# EAGLE design pc_kalam32_dev (EAGLE 6.4)
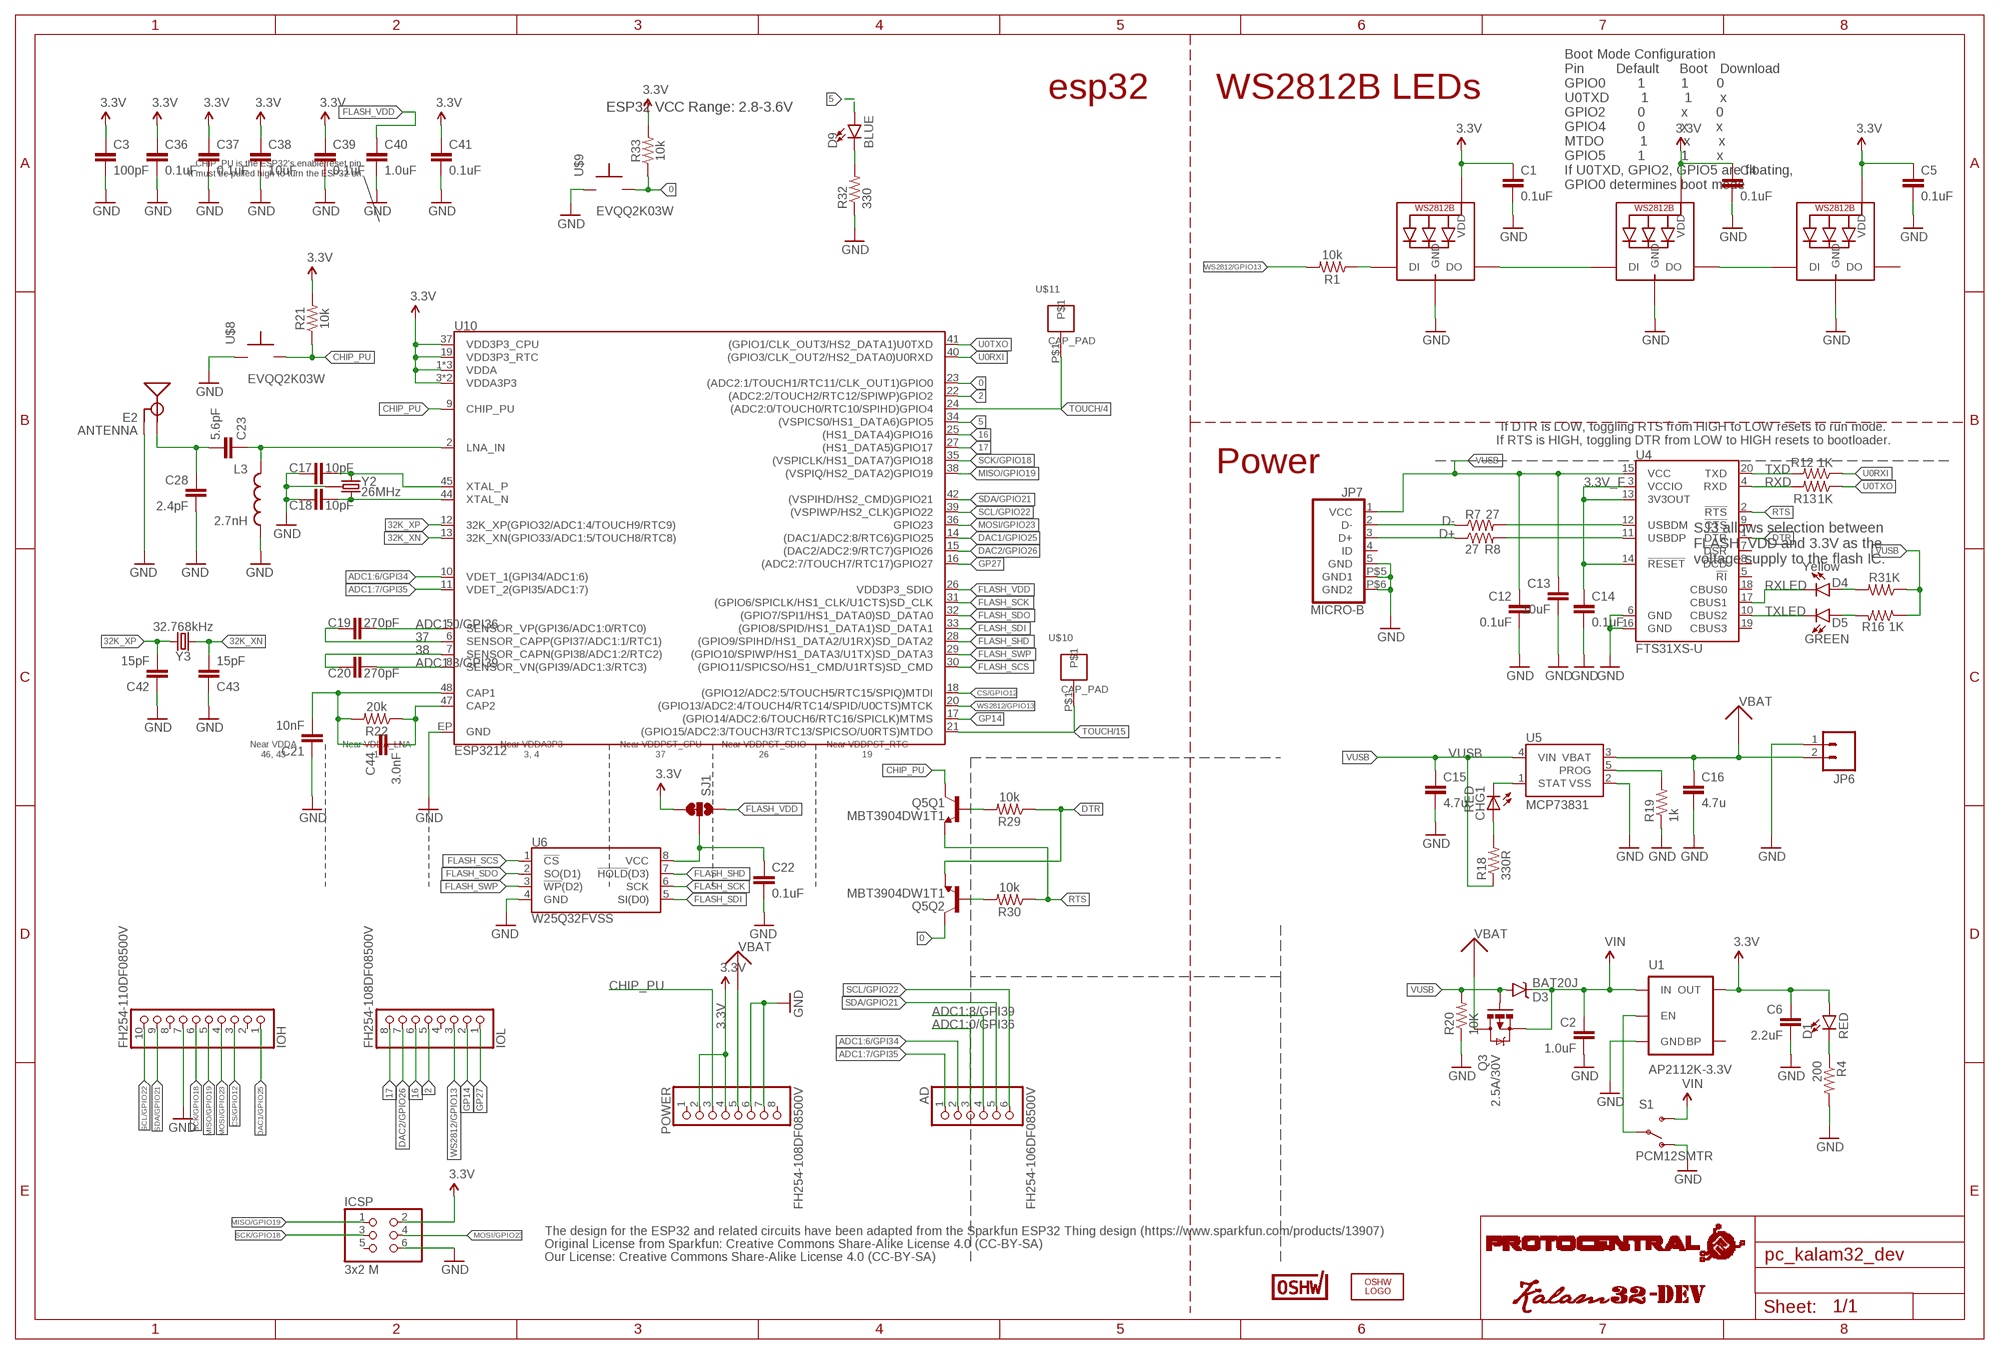
[diagram p0: schematic, sheet 1]

## Parts
AD  FH254-106DF08500V  1682_20TW-535_STD  [1X06]
C1  0.1uF  0.1UF-0603-25V-(+80/-20%)  [0603]
C2  1.0uF  C-EUC0402  [C0402]
C3  100pF  100PF-0603-50V-5%  [0603]
C4  0.1uF  0.1UF-0603-25V-(+80/-20%)  [0603]
C5  0.1uF  0.1UF-0603-25V-(+80/-20%)  [0603]
C6  2.2uF  2.2UF-10V-20%(0603)  [0603-CAP@1]
C12  0.1uF  C-EUC0402  [C0402]
C13  10uF  C-EUC0805  [C0805]
C14  0.1uF  C-EUC0402  [C0402]
C15  4.7u  C-EUC0805  [C0805]
C16  4.7u  C-EUC0805  [C0805]
C17  10pF  10PF-0603-50V-5%  [0603]
C18  10pF  10PF-0603-50V-5%  [0603]
C19  270pF  270PF-50V-5%(0603)  [0603]
C20  270pF  270PF-50V-5%(0603)  [0603]
C21  10nF  10NF-0603-50V-10%  [0603]
C22  0.1uF  0.1UF-0603-25V-(+80/-20%)  [0603]
C23  5.6pF  5.6PF-50V-5%(0603)  [0603]
C28  2.4pF  2.4PF-0603-50V-5%  [0603]
C36  0.1uF  0.1UF-0603-25V-(+80/-20%)  [0603]
C37  0.1uF  0.1UF-0603-25V-(+80/-20%)  [0603]
C38  10uF  10UF-0603-6.3V-20%  [0603]
C39  0.1uF  0.1UF-0603-25V-(+80/-20%)  [0603]
C40  1.0uF  1.0UF-0603-16V-10%  [0603]
C41  0.1uF  0.1UF-0603-25V-(+80/-20%)  [0603]
C42  15pF  15PF-0603-50V-5%  [0603]
C43  15pF  15PF-0603-50V-5%  [0603]
C44  3.0nF  3.0NF-0603-50V-5%  [0603]
CHG1  RED  LEDCHIPLED_0603  [CHIPLED_0603]
D1  RED  LED-RED0603  [LED-0603]
D3  BAT20J  DIODE-SCHOTTKY-BAT20J  [SOD-323]
D4  Yellow  LED-YELLOW0603  [LED-0603]
D5  GREEN  LED-GREEN0603  [LED-0603@1]
D9  BLUE  LED-BLUE0603  [LED-0603]
E2  ANTENNA  ANTENNATRACE-TUNED  [TRACE_ANTENNA_2.4GHZ_25.7MM_TUNED]
ICSP  3x2 M  0114_PH254-203DF118A00V  [2X03]
IOH  FH254-110DF08500V  1684_20TW-537  [1X10]
IOL  FH254-108DF08500V  1683_20TW-536  [1X08]
JP6  M02-JST-2MM-SMT  [JST-2-SMD]
JP7  MICRO-B  [MICRO-B]
L3  2.7nH  INDUCTOR0603  [0603]
LED1  WS2812B5050  [WS2812B]
LED2  WS2812B5050  [WS2812B]
LED3  WS2812B5050  [WS2812B]
LOGO2  OSHW_LOGO_FILLX0200-NT  [OSHW_FILLX200_NOTEXT]
POWER  FH254-108DF08500V  1683_20TW-536  [1X08]
Q3  2.5A/30V  MOSFET-PCHANNELDMG2307L  [SOT23-3]
Q5  MBT3904DW1T1  [SC70-6]
R1  10k  10KOHM-1/10W-1%(0603)0603  [0603]
R3  1K  R-US_R0402  [R0402]
R4  200  R-US_R0402  [R0402]
R7  27  R-US_R0402  [R0402]
R8  27  R-US_R0402  [R0402]
R12  1K  R-US_R0402  [R0402]
R13  1K  R-US_R0402  [R0402]
R16  1K  R-US_R0402  [R0402]
R18  330R  R-US_R0402  [R0402]
R19  1k  R-US_R0402  [R0402]
R20  10K  R-US_R0402  [R0402]
R21  10k  10KOHM-1/10W-1%(0603)0603  [0603]
R22  20k  20KOHM-0603-1/10W-1%  [0603]
R29  10k  10KOHM-0603-1/10W-1%  [0603]
R30  10k  10KOHM-0603-1/10W-1%  [0603]
R32  330  R-US_R0805  [R0805]
R33  10k  10KOHM-1/10W-1%(0603)0603  [0603]
S1  PCM12SMTR  SWITCH-SPDT-SMD-A  [SWITCH-SPST-SMD-A]
SJ1  JUMPER-PAD-3-2OF3_NC_BY_TRACE_SMALL  [PAD-JUMPER-3-2OF3_NC_BY_TRACE_YES_SILK_FULL_BOX]
U1  AP2112K-3.3V  V_REG_LDOSMD  [SOT23-5]
U4  FTS31XS-U  FT231XS  [SSOP20_L]
U5  MCP73831  [SOT23-5]
U6  W25Q32FVSS  [SOIC-8]
U10  ESP3212  [QFN48-0.4MM]
U$5  CERT-MEDIUM  [CERT-MED-SILK]
U$8  EVQQ2K03W  [EVQQ2]
U$9  EVQQ2K03W  [EVQQ2]
U$10  CAP_PAD  [CAP_PAD]
U$11  CAP_PAD  [CAP_PAD]
U$12  KALAM32-DEV  [KALAM32-DEV]
U$13  PROTY_LOGO_WITH_TEXT  [PROTY_WITH_TEXT]
Y2  26MHz  CRYSTAL-GROUNDED3.2X2.5  [CRYSTAL-SMD-3.2X2.5]
Y3  32.768kHz  CRYSTAL-32.768KHZSMD-3.2X1.5  [CRYSTAL-SMD-3.2X1.5MM]

## Nets
0: Q5.6(Q2:C) R33.1 U10.23((ADC2:1/TOUCH1/RTC11/CLK_OUT1)GPIO0) U$9.P$3
2: IOL.5 U10.22((ADC2:2/TOUCH2/RTC12/SPIWP)GPIO2)
3.3V: C1.1 C3.1 C4.1 C5.1 C6.1 C36.1 C37.1 C38.1 C39.1 C41.1 D1.A ICSP.2 LED1.1-VDD(VDD) LED2.1-VDD(VDD) LED3.1-VDD(VDD) POWER.2 POWER.4 R21.2 R33.2 SJ1.3 U1.5(OUT) U10.1(VDDA) U10.3(VDDA3P3) U10.4(VDDA3P3) U10.19(VDD3P3_RTC) U10.37(VDD3P3_CPU) U10.43(VDDA) U10.46(VDDA)
3.3V_F: C14.1 U4.3(VCCIO) U4.13(3V3OUT) U4.14(!RESET)
5: D9.A U10.34((VSPICS0/HS1_DATA6)GPIO5)
16: IOL.6 U10.25((HS1_DATA4)GPIO16)
17: IOL.8 U10.27((HS1_DATA5)GPIO17)
32K_XN: C43.2 U10.13(32K_XN(GPIO33/ADC1:5/TOUCH8/RTC8)) Y3.P$2
32K_XP: C42.2 U10.12(32K_XP(GPIO32/ADC1:4/TOUCH9/RTC9)) Y3.P$1
37: C19.1 U10.6(SENSOR_CAPP(GPI37/ADC1:1/RTC1))
38: C20.1 U10.7(SENSOR_CAPN(GPI38/ADC1:2/RTC2))
ADC1:0/GPI36: AD.3 C19.2 U10.5(SENSOR_VP(GPI36/ADC1:0/RTC0))
ADC1:3/GPI39: AD.4 C20.2 U10.8(SENSOR_VN(GPI39/ADC1:3/RTC3))
ADC1:6/GPI34: AD.2 U10.10(VDET_1(GPI34/ADC1:6))
ADC1:7/GPI35: AD.1 U10.11(VDET_2(GPI35/ADC1:7))
CAP_10N: C21.2 C44.1 R22.2 U10.48(CAP1)
CHIP_PU: POWER.3 Q5.3(Q1:C) R21.1 U10.9(CHIP_PU) U$8.P$3
CS/GPIO12: IOH.3 U10.18((GPIO12/ADC2:5/TOUCH5/RTC15/SPIQ)MTDI)
D+: JP7.3(D+) R8.1
D-: JP7.2(D-) R7.1
DAC1/GPIO25: IOH.1 U10.14((DAC1/ADC2:8/RTC6)GPIO25)
DAC2/GPIO26: IOL.7 U10.15((DAC2/ADC2:9/RTC7)GPIO26)
DTR: Q5.1(Q2:E) R29.1 U4.1(!DTR)
FLASH_SCK: U6.6(SCK) U10.31((GPIO6/SPICLK/HS1_CLK/U1CTS)SD_CLK)
FLASH_SCS: U6.1(!CS!) U10.30((GPIO11/SPICSO/HS1_CMD/U1RTS)SD_CMD)
FLASH_SDI: U6.5(SI(D0)) U10.33((GPIO8/SPID/HS1_DATA1)SD_DATA1)
FLASH_SDO: U6.2(SO(D1)) U10.32((GPIO7/SPI1/HS1_DATA0)SD_DATA0)
FLASH_SHD: U6.7(!HOLD!(D3)) U10.28((GPIO9/SPIHD/HS1_DATA2/U1RX)SD_DATA2)
FLASH_SWP: U6.3(!WP!(D2)) U10.29((GPIO10/SPIWP/HS1_DATA3/U1TX)SD_DATA3)
FLASH_VDD: C40.1 SJ1.1 U10.26(VDD3P3_SDIO)
GND [gnd]: C1.2 C2.2 C3.2 C4.2 C5.2 C6.2 C12.2 C13.2 C14.2 C15.2 C16.2 C17.1 C18.1 C21.1 C22.2 C28.2 C36.2 C37.2 C38.2 C39.2 C40.2 C41.2 C42.1 C43.1 E2.GND E2.GND2(GND) ICSP.6 IOH.7 JP6.1 JP7.5(GND) JP7.P$5(GND1) JP7.P$6(GND2) L3.2 LED1.3-GND(GND) LED2.3-GND(GND) LED3.3-GND(GND) POWER.6 POWER.7 R4.2 R19.1 R20.1 R32.1 S1.1(O) U1.2(GND) U4.6(GND) U4.16(GND) U5.2(VSS) U6.4(GND) U10.EP(GND) U$8.P$1 U$9.P$1 Y2.2(GND) Y2.4(GND)
GP14: IOL.2 U10.17((GPIO14/ADC2:6/TOUCH6/RTC16/SPICLK)MTMS)
GP27: IOL.1 U10.16((ADC2:7/TOUCH7/RTC17)GPIO27)
LNA_IN: C23.1 L3.1 U10.2(LNA_IN)
MISO/GPIO19: ICSP.1 IOH.5 U10.38((VSPIQ/HS2_DATA2)GPIO19)
MOSI/GPIO23: ICSP.4 IOH.4 U10.36(GPIO23)
N$3: LED1.2-DOUT(DO) LED2.4-DIN(DI)
N$4: LED2.2-DOUT(DO) LED3.4-DIN(DI)
N$5: LED1.4-DIN(DI) R1.1
N$8: D5.A R16.2
N$9: R7.2 U4.12(USBDM)
N$10: D4.A R3.2
N$11: R8.2 U4.11(USBDP)
N$12: D1.C R4.1
N$13: CHG1.C U5.1(STAT)
N$14: S1.2(P) U1.3(EN)
N$16: CHG1.A R18.2
N$17: C22.1 SJ1.2 U6.8(VCC)
N$19: R19.2 U5.5(PROG)
N$23: Q5.5(Q1:B) R29.2
N$24: Q5.2(Q2:B) R30.2
N$25: C17.2 U10.45(XTAL_P) Y2.1
N$26: C18.2 U10.44(XTAL_N) Y2.3
N$29: D9.C R32.2
N$30: C44.2 R22.1 U10.47(CAP2)
RTS: Q5.4(Q1:E) R30.1 U4.2(!RTS)
RXD: R13.2 U4.4(RXD)
RXLED: D4.C U4.17(CBUS1)
SCK/GPIO18: ICSP.3 IOH.6 U10.35((VSPICLK/HS1_DATA7)GPIO18)
SCL/GPIO22: AD.6 IOH.10 U10.39((VSPIWP/HS2_CLK)GPIO22)
SDA/GPIO21: AD.5 IOH.9 U10.42((VSPIHD/HS2_CMD)GPIO21)
TOUCH/4: U10.24((ADC2:0/TOUCH0/RTC10/SPIHD)GPIO4) U$11.P$1
TOUCH/15: U10.21((GPIO15/ADC2:3/TOUCH3/RTC13/SPICSO/U0RTS)MTDO) U$10.P$1
TRACE_ANT1: C23.2 C28.1 E2.ANT(SIGNAL)
TXD: R12.2 U4.20(TXD)
TXLED: D5.C U4.10(CBUS2)
U0RXI: R12.1 U10.40((GPIO3/CLK_OUT2/HS2_DATA0)U0RXD)
U0TXO: R13.1 U10.41((GPIO1/CLK_OUT3/HS2_DATA1)U0TXD)
VBAT: C16.1 JP6.2 POWER.5 Q3.3(D) U5.3(VBAT)
VIN: C2.1 D3.C Q3.2(S) S1.3(S) U1.1(IN)
VUSB: C12.1 C13.1 C15.1 D3.A JP7.1(VCC) Q3.1(G) R3.1 R16.1 R18.1 R20.2 U4.15(VCC) U5.4(VIN)
WS2812/GPIO13: IOL.3 R1.2 U10.20((GPIO13/ADC2:4/TOUCH4/RTC14/SPID/U0CTS)MTCK)
Unconnected: ICSP.5 IOH.2 IOH.8 IOL.4 JP7.4(ID) LED3.2-DOUT(DO) POWER.1 POWER.8 U1.4(BP) U4.5(!RI) U4.7(!DSR) U4.8(!DCD) U4.9(!CTS) U4.18(CBUS0) U4.19(CBUS3)

## Notes on the sheet
- esp32 | WS2812B LEDs
- ESP32 VCC Range: 2.8-3.6V
- CHIP_PU is the ESP32's enable/reset pin.
  It must be pulled high to turn the ESP32 on.
- Boot Mode Configuration
  Pin        Default     Boot   Download
  GPIO0        1         1       0
  U0TXD        1         1       x
  GPIO2        0         x       0
  GPIO4        0         x       x
  MTDO         1         x       x
  GPIO5        1         1       x
  If U0TXD, GPIO2, GPIO5 are floating, 
  GPIO0 determines boot mode
- If DTR is LOW, toggling RTS from HIGH to LOW resets to run mode.
  If RTS is HIGH, toggling DTR from LOW to HIGH resets to bootloader.
- Power
- SJ3 allows selection between 
  FLASH_VDD and 3.3V as the
  voltage supply to the flash IC.
- Near VDDA
  46, 43
- Near VDDA_LNA
  1
- Near VDDA3P3
  3, 4
- Near VDDPST_CPU
  37
- Near VDDPST_SDIO
  26
- Near VDDPST_RTC
  19
- The design for the ESP32 and related circuits have been adapted from the Sparkfun ESP32 Thing design (https://www.sparkfun.com/products/13907)
- Original License from Sparkfun: Creative Commons Share-Alike License 4.0 (CC-BY-SA)
- Our License: Creative Commons Share-Alike License 4.0 (CC-BY-SA)

## Library data of the parts
AD = Connettori:1682_20TW-535: Female Gray Connector strip for Arduino 3V3 bases - 6x1 F V h 8,5 p2,54; MONTHLY_USAGE: 86722.85; PART_NUMBER: 20TW-535; PRICE: _0.03; SUPPLIER: CBC_elettronica__s.r.l.; TYPE: Connettori
C1 C4 C5 C22 C36 C37 C39 C41 = SparkFun-Capacitors:0.1UF: 0.1µF ceramic capacitors A capacitor is a passive two-terminal electrical component used to store electrical energy temporarily in an electric field.; PROD_ID: CAP-00810
C2 C12-C16 = rcl:C-EU: CAPACITOR, European symbol
C3 = SparkFun-Capacitors:100PF: 100pF/0.1nF ceramic capacitors A capacitor is a passive two-terminal electrical component used to store electrical energy temporarily in an electric field.; PROD_ID: CAP-07883
C6 = SparkFun-Capacitors:2.2UF-10V-20%(0603): CAP-07888; PROD_ID: CAP-07888
C17 C18 = SparkFun-Capacitors:10PF: 10pF ceramic capacitors A capacitor is a passive two-terminal electrical component used to store electrical energy temporarily in an electric field.; PROD_ID: CAP-11812
C19 C20 = esp32-thing-temp:270PF-50V-5%(0603): CAP-13339; PROD_ID: CAP-13339
C21 = SparkFun-Capacitors:10NF: 0.01uF/10nF/10,000pF ceramic capacitors A capacitor is a passive two-terminal electrical component used to store electrical energy temporarily in an electric field. CAP-09321; PROD_ID: CAP-00867
C23 = esp32-thing-temp:5.6PF-50V-5%(0603): CAP-12456; PROD_ID: CAP-12456
C28 = esp32-thing-temp:2.4PF: 2.4pF ceramic capacitors A capacitor is a passive two-terminal electrical component used to store electrical energy temporarily in an electric field.; PROD_ID: CAP-13541
C38 = SparkFun-Capacitors:10UF: 10.0µF ceramic capacitors A capacitor is a passive two-terminal electrical component used to store electrical energy temporarily in an electric field.; PROD_ID: CAP-11015
C40 = SparkFun-Capacitors:1.0UF: 1µF ceramic capacitors A capacitor is a passive two-terminal electrical component used to store electrical energy temporarily in an electric field.; PROD_ID: CAP-00868
C42 C43 = SparkFun-Capacitors:15PF: 15pF ceramic capacitors A capacitor is a passive two-terminal electrical component used to store electrical energy temporarily in an electric field.; PROD_ID: CAP-07881
C44 = esp32-thing-temp:3.0NF: 3.0nF (3nF, 3000pF) ceramic capacitors A capacitor is a passive two-terminal electrical component used to store electrical energy temporarily in an electric field.; PROD_ID: CAP-13515
CHG1 = led:LED: LED OSRAM: - CHIPLED LG R971, LG N971, LY N971, LG Q971, LY Q971, LO R971, LY R971 LH N974, LH R974 LS Q976, LO Q976, LY Q976 LO Q996 - Hyper CHIPLED LW Q18S LB Q993, LB Q99A, LB R99A - SideLED LS A670, LO A670, LY A670, LG A670, LP A670 LB A673, LV A673, LT A673, LW A673 LH A674 LY A675 LS A676, LA A676, LO A676, LY A676, LW A676 LS A679, LY A679, LG A679 - Hyper Micro SIDELED® LS Y876, LA Y876, LO Y876, LY Y876 LT Y87S - SmartLED LW L88C, LW L88S LB L89C, LB L89S, LG L890 LS L89K, LO L89K, LY L89K LS L896, LA L896, LO L896, LY L896 - TOPLED LS T670, LO T670, LY T670, LG T670, LP T670 LSG T670, LSP T670, LSY T670, LOP T670, LYG T670 LG T671, LOG T671, LSG T671 LB T673, LV T673, LT T673, LW T673 LH T674 LS T676, LA T676, LO T676, LY T676, LB T676, LH T676, LSB T676, LW T676 LB T67C, LV T67C, LT T67C, LS T67K, LO T67K, LY T67K, LW E67C LS E67B, LA E67B, LO E67B, LY E67B, LB E67C, LV E67C, LT E67C LW T67C LS T679, LY T679, LG T679 LS T770, LO T770, LY T770, LG T770, LP T770 LB T773, LV T773, LT T773, LW T773 LH T774 LS E675, LA E675, LY E675, LS T675 LS T776, LA T776, LO T776, LY T776, LB T776 LHGB T686 LT T68C, LB T68C - Hyper Mini TOPLED® LB M676 - Mini TOPLED Santana® LG M470 LS M47K, LO M47K, LY M47K Source: http://www.osram.convergy.de LUXEON: - LUMILED® LXK2-PW12-R00, LXK2-PW12-S00, LXK2-PW14-U00, LXK2-PW14-V00 LXK2-PM12-R00, LXK2-PM12-S00, LXK2-PM14-U00 LXK2-PE12-Q00, LXK2-PE12-R00, LXK2-PE12-S00, LXK2-PE14-T00, LXK2-PE14-U00 LXK2-PB12-K00, LXK2-PB12-L00, LXK2-PB12-M00, LXK2-PB14-N00, LXK2-PB14-P00, LXK2-PB14-Q00 LXK2-PR12-L00, LXK2-PR12-M00, LXK2-PR14-Q00, LXK2-PR14-R00 LXK2-PD12-Q00, LXK2-PD12-R00, LXK2-PD12-S00 LXK2-PH12-R00, LXK2-PH12-S00 LXK2-PL12-P00, LXK2-PL12-Q00, LXK2-PL12-R00 Source: www.luxeon.com KINGBRIGHT: KA-3528ASYC Source: www.kingbright.com
D1 = SparkFun-LED:LED-RED: Red SMD LED Used in manufacturing of most products at SparkFun 0603 - SMD 0603 package Forward Voltage: 1.9V Forward Current: 20mA Datasheet: [Product Link] <http://docs.avagotech.com/docs/AV02-0551EN> 0603 SMART - SMD 0603 SMART package ( more efficient and expensive) Forward Voltage: 1.8V Forward Current: 20mA Datasheet: [Product Link] <http://www.osram-os.com/Graphics/XPic2/00077099_0.pdf> 1206 - SMD 1206 package Forward Voltage: 2V Forward Current: 20mA Datasheet: [Product Link] <https://www.sparkfun.com/datasheets/DevTools/LilyPad/Q150OVS4.pdff> 1206 LilyPad - SMD 1206 LilyPad package Forward Voltage: 2V Forward Current: 20mA Datasheet: [Product Link] <https://www.sparkfun.com/datasheets/DevTools/LilyPad/Q150OVS4.pdf>; PROD_ID: DIO-00819
D3 = SparkFun-DiscreteSemi:DIODE-SCHOTTKY: Schottky diodes in SFE's production catalog BAT20J 1A 23V 0.62Vf RB751 120mA 40V 0.37Vf PMEG4005EJ 0.5A 40V 0.42Vf MBRA140 1A 40V 0.5Vf B340A 3A 40V SMA; PROD_ID: DIO-11623
D4 = SparkFun-LED:LED-YELLOW: Yellow SMD LEDs LilyPad 1206- DIO-09909 0603- DIO-09003 "SMART" means more efficient and expensive; PROD_ID: DIO-09003
D5 = SparkFun-LED:LED-GREEN: Various green LEDs Green LEDs used in SFE Production 0603- DIO-00821 LARGE- DIO-00862 LILYPAD- DIO-09910; PROD_ID: DIO-00821
D9 = SparkFun-LED:LED-BLUE: Blue SMD LED Used in manufacturing of various products at SparkFun 0603 - SMD 0603 package Manufacturer: Rohm Semiconductor Forward Voltage: 2.9V Forward Current: 5mA Wavelength: 470nm Digikey: [Product Link] <http://www.digikey.com/product-detail/en/SMLE12BC7TT86/511-1589-2-ND/1641808> 1206 - SMD1206 package Manufacturer:Lite-On Inc. Forward Voltage: 3.3V Forward Current: 20mA Wavelength: 468nm Digikey: [Product Link] <http://www.digikey.com/product-detail/en/lite-on-inc/LTST-C150TBKT/160-1643-1-ND/573584>; PROD_ID: DIO-08575
E2 = esp32-thing-temp:ANTENNA: Chip antenna Chip antenna with ground or secondary connection. Common with larger metal RF connectors.
ICSP = Connettori:0114_PH254-203DF118A00V: 3x2 M V h 8,5 mm p2,54; MONTHLY_USAGE: _____; PART_NUMBER: PH254-203DF118A00V; PRICE: _____; SUPPLIER: _____; TYPE: Connettori; VALUE: ICSP
IOH = Connettori:1684_20TW-537: Female Gray Connector strip for Arduino 3V3 bases - 10x1 F V h 8,5 p2,54mm; MONTHLY_USAGE: _____; PART_NUMBER: 20TW-537; PRICE: _____; SUPPLIER: _____; TYPE: Connettori
IOL POWER = Connettori:1683_20TW-536: Female Gray Connector strip for Arduino 3V3 bases - 8x1 F V h 8,5 p2,54mm; MONTHLY_USAGE: _____; PART_NUMBER: 20TW-536; PRICE: _____; SUPPLIER: _____; TYPE: Connettori
JP6 = SparkFun:M02: Header 2 Standard 2-pin 0.1" header. Use with straight break away headers (SKU : PRT-00116), right angle break away headers (PRT-00553), swiss pins (PRT-00743), machine pins (PRT-00117), and female headers (PRT-00115). Molex polarized connector foot print use with SKU : PRT-08233 with associated crimp pins and housings.
JP7 = circuitects:MICRO-B
L3 = SparkFun-Passives:INDUCTOR: Inductors Basic Inductor/Choke - 0603 and 1206. Footprints are not proven and vary greatly between part numbers. INDUCTOR POWER 3.3UH 4.0A SMD 0.197" L x 0.197" W x 0.177" H (5.00mm x 5.00mm x 4.50mm); PROD_ID: NDUC-08762
LED1-LED3 = adafruit:WS2812B
LOGO2 = ohw-logo:OSHW_LOGO_FILL
Q3 = SparkFun-DiscreteSemi:MOSFET-PCHANNEL: Generic PMOSFET IRLML2244 - TRANS-11153 (SOT-23 -20V -4.3A) (1.Gate 2.Source 3.Drain) FQP27P06 - COM-10349 <http://www.sparkfun.com/products/10349> (TO-220 -60V -27A) (1.Gate 2.Source 3.Drain); PROD_ID: TRANS-11308
Q5 = esp32-thing-temp:MBT3904DW1T1: MBT3904DW1 Dual NPN Transistors The MBT3904W1 puts two general purpose 3904 NPN transistors in a single package. Datasheet <http://www.onsemi.com/pub_link/Collateral/MBT3904DW1T1-D.PDF>; PROD_ID: TRANS-13337
R1 R21 R33 = SparkFun-Resistors:10KOHM-1/10W-1%(0603): RES-00824; PROD_ID: RES-00824; VALUE: 10K
R3 R4 R7 R8 R12 R13 R16 R18-R20 R32 = rcl:R-US_: RESISTOR, American symbol
R22 = SparkFun-Resistors:20KOHM: 20kΩ resistor A resistor is a passive two-terminal electrical component that implements electrical resistance as a circuit element. Resistors act to reduce current flow, and, at the same time, act to lower voltage levels within circuits. - Wikipedia; PROD_ID: RES-09383
R29 R30 = SparkFun-Resistors:10KOHM: 10kΩ resistor A resistor is a passive two-terminal electrical component that implements electrical resistance as a circuit element. Resistors act to reduce current flow, and, at the same time, act to lower voltage levels within circuits. - Wikipedia; PROD_ID: RES-00824
S1 = SparkFun-Electromechanical:SWITCH-SPDT: SPDT Switch Simple slide switch, Spark Fun Electronics SKU : COM-00102 DPDT SMT slide switch, AYZ0202, SWCH-08179; PROD_ID: SWCH-10651
SJ1 = SparkFun-Passives:JUMPER-PAD-3-2OF3_NC_BY_TRACE
U1 = SparkFun-PowerIC:V_REG_LDO: Voltage Regulator LDO Standard 150mA LDO voltage regulator in SOT-23 layout. Micrel part MIC5205. BP (by-pass) pin is used to lower output noise with 470pF cap.; PROD_ID: VREG-12457
U4 = SparkFun-DigitalIC:FT231X: FTDI FT231X Full Speed USB to Full-handshake UART This USB2.0 Full Speed IC offers a compact bridge to full handshake UART interfaces. The device is a UART, capable of operating up to 3MBaud, with low power consumption (8mA). The FT231X includes the complete FT-X series feature set and enables USB to be added into a system design quickly and easily over a UART interface.; PROD_ID: IC-11524; VALUE: FT231XS
U5 = SparkFun:MCP73831: Microchip's MCP73831 Miniature single cell, fully integrated Li-Ion, Li-polymer charge management controller http://ww1.microchip.com/downloads/en/DeviceDoc/21984a.pdf
U6 = SparkFun-DigitalIC:W25Q32FV: Winbond W25Q32FV 32Mbit (4MB) Flash The W25Q32FV support the standard Serial Peripheral Interface (SPI), Dual/Quad I/O SPI as well as 2-clocks instruction cycle Quad Peripheral Interface (QPI). Datasheet <http://www.winbond.com/resource-files/w25q32fv%20revh%20091613.pdf>; PROD_ID: IC-13229
U10 = esp32-thing-temp:ESP3212; PROD_ID: IC-13338
U$5 = OSHWA:CERT
U$8 U$9 = circuitects:EVQQ2K03W
U$10 U$11 = circuitects:CAP_PAD
U$12 = circuitects:KALAM32-DEV
U$13 = circuitects:PROTY_LOGO_WITH_TEXT
Y2 = things:CRYSTAL-GROUNDED; PROD_ID: XTAL-12454
Y3 = SparkFun-Clocks:CRYSTAL-32.768KHZ: 32.768kHz Crystal Frequency: 32.768kHz Frequency Stability: ±20ppm Load Capacitance: 12.5pF (PTH-2X6 & SMD-3.2X1.5), 6pF (SMD-2X6); PROD_ID: XTAL-13062

## Net classes
1 USB: width 0.203 mm, drill 0.305 mm, clearance 0.178 mm
2 gnd: width 0.254 mm, drill 0.254 mm, clearance 0.178 mm
3 usbvcc: width 0.203 mm, drill 0.406 mm, clearance 0.178 mm
4 USBpair: width 0.254 mm, drill 0.406 mm, clearance 0.406 mm

## Board
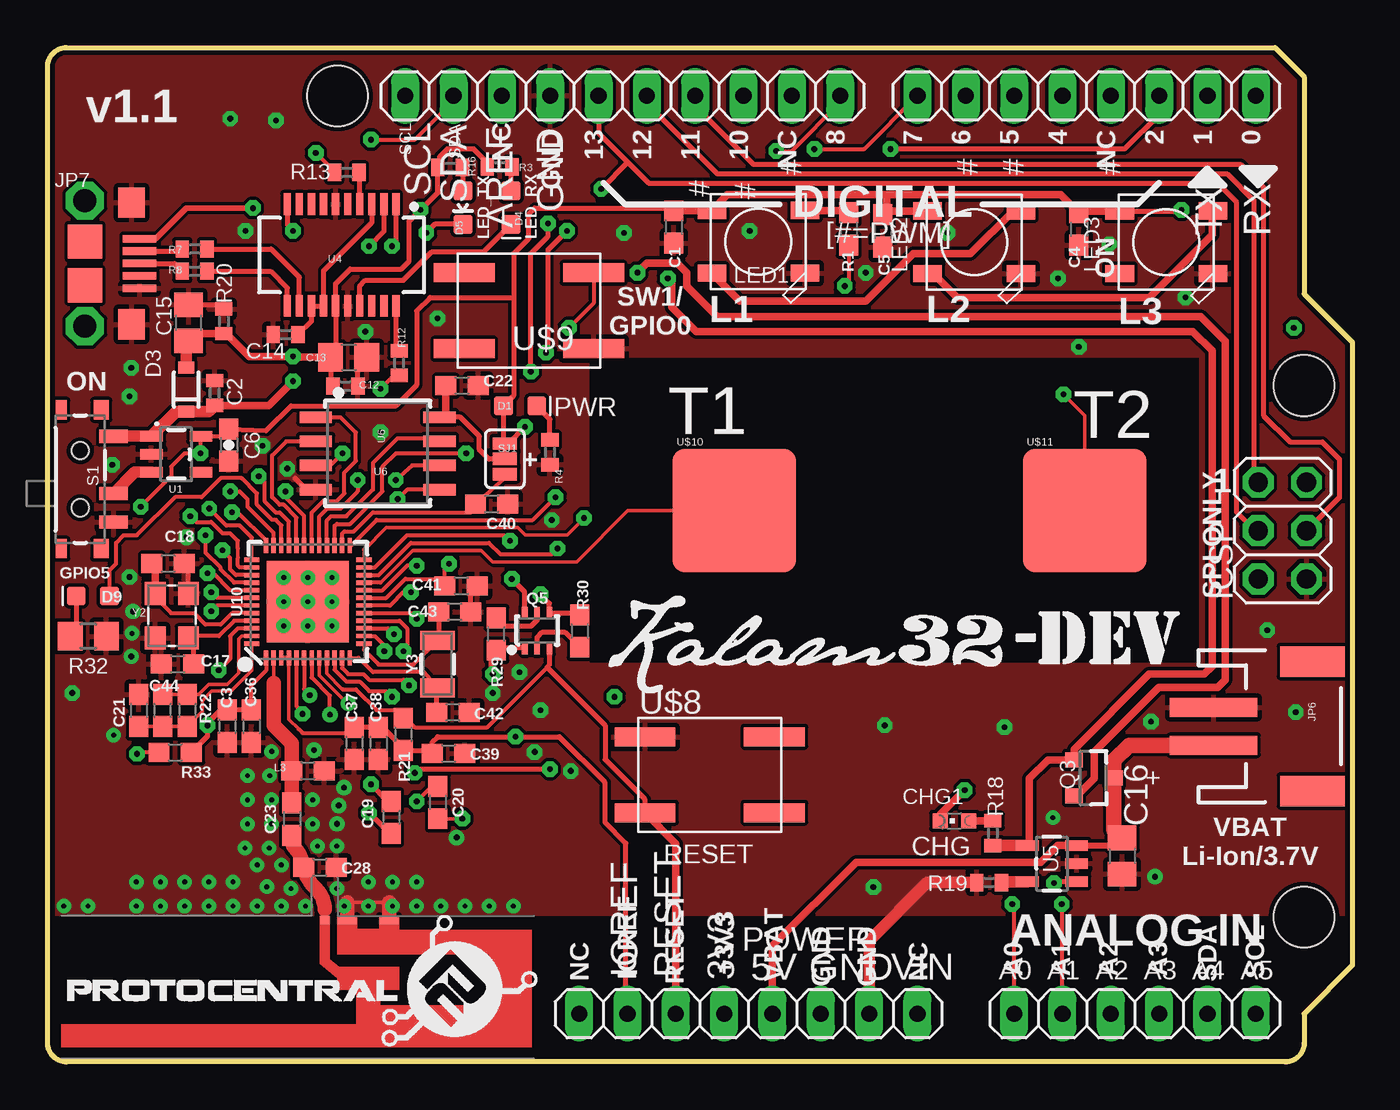
[diagram p1: board, top side]
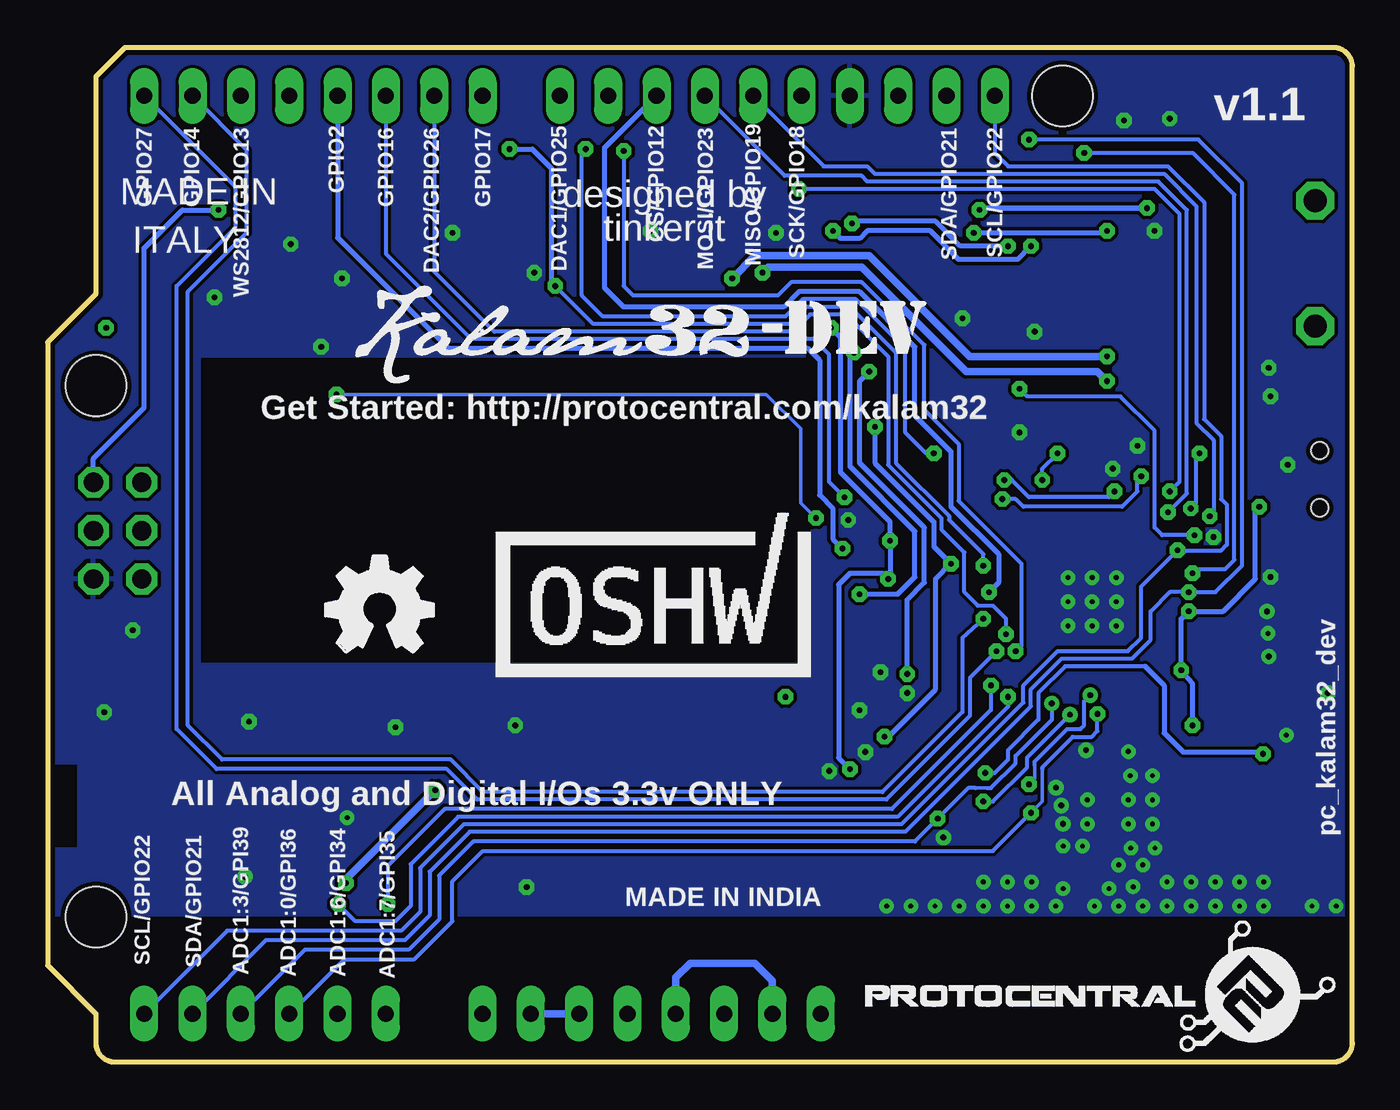
[diagram p2: board, bottom side, seen from below]

Size 68.58 x 53.34 mm. Coordinates in mm from the lower left corner, seen from the top.
Outline: 26.15,0.04 0.99,0.04
Outline: 64.52,53.34 66.04,51.82 66.04,40.39 68.58,37.85 68.58,5.08 66.04,2.54 66.04,1 arc-90 65.04,0 1,0 arc-90 0,1 0,52.34 arc-90 1,53.34 64.52,53.34
Copper layers (1*2*15*16): Top 0.035mm / dielectric 1.5mm / Route2 0.035mm / dielectric 0.15mm / Ground 0.035mm / dielectric 0.2mm / Bottom 0.035mm
Design rules "Circuitects-Rules": minimum track width 6mil, minimum drill 0.3mm, track to track 6mil, track to pad 6mil, pad to pad 6mil, via to via 6mil, smd to smd 6mil, copper to edge 10mil, drill to drill 8mil, minimum pad ring 12mil, minimum via ring 10mil, stop-mask expansion 4mil, vias tented up to drill 25mil, thermal gap 10mil
Holes 3.2 mm at 66.04,35.56 66.04,7.62 15.24,50.8
tRestrict: area 28.5,21 to 60.5,37
bRestrict: area 67.1,11.3 to 68.8,15.6; area 28.5,21 to 60.5,37
vRestrict: area 22.9,44.1 to 24.6,49.1; area 25.4,45.5 to 27.1,49.1; area 28.4,45.3 to 29.6,48.8; area 31,45.3 to 32.1,48.8; area 33.5,45.3 to 34.7,48.8; area 36.1,45.3 to 37.2,48.8; area 38.7,47.2 to 39.9,48.8; area 40.3,45.1 to 47.6,46.9; area 60.3,44.2 to 61.7,46.7; area 62.9,44.2 to 64.3,46.7; area 10,28.1 to 10.7,28.6; area 50.4,10.2 to 50.9,11; 9 more areas

### Footprints (pad centres in the part's own frame; a part is rotated, then mirrored left to right if it is on the bottom)
1X06 = drill 0.85 pad 1.422 long: 1 -6.35,0; 2 -3.81,0; 3 -1.27,0; 4 1.27,0; 5 3.81,0; 6 6.35,0
0603 = smd 1.1 x 1: 1 -0.85,0; 2 0.85,0
C0402 = smd 0.7 x 0.9: 1 -0.65,0; 2 0.65,0
0603-CAP@1 = smd 1.1 x 1: 1 -0.85,0; 2 0.85,0
C0805 = smd 1.3 x 1.5: 1 -0.95,0; 2 0.95,0
CHIPLED_0603 = smd 0.8 x 0.8: A 0,-0.75; C 0,0.75
LED-0603 = smd 1 x 1: A 0,-0.877; C 0,0.877
SOD-323 = smd 0.63 x 0.83: A 1.15,0; C -1.15,0
LED-0603@1 = smd 1 x 1: A 0,-0.877; C 0,0.877
TRACE_ANTENNA_2.4GHZ_25.7MM_TUNED = smd 0.46 x 0.46: ANT 0,0.23 | smd 1 x 0.46: GND -1.18,0.23; GND2 -3.38,0.23
2X03 = drill 1.016 pad 1.55 octagon: 1 -2.54,-1.27; 2 -2.54,1.27; 3 0,-1.27; 4 0,1.27; 5 2.54,-1.27; 6 2.54,1.27
1X10 = drill 0.85 pad 1.422 long: 1 -11.43,0; 2 -8.89,0; 3 -6.35,0; 4 -3.81,0; 5 -1.27,0; 6 1.27,0; 7 3.81,0; 8 6.35,0; 9 8.89,0; 10 11.43,0
1X08 = drill 0.85 pad 1.422 long: 1 -8.89,0; 2 -6.35,0; 3 -3.81,0; 4 -1.27,0; 5 1.27,0; 6 3.81,0; 7 6.35,0; 8 8.89,0
JST-2-SMD = smd 1 x 4.6: 1 -1,-3.7; 2 1,-3.7 | smd 1.6 x 3.4: NC1 -3.4,1.5; NC2 3.4,1.5
MICRO-B = smd 0.4 x 1.75: 1 -1.25,2.975; 2 -0.6,2.975; 3 0.05,2.975; 4 0.7,2.975; 5 1.35,2.975 | smd 1.8 x 1.8: P$1 -1.1,0.1; P$2 1.2,0.1 | drill 1.2 pad 2 octagon: P$3 -3.25,0.1; P$4 3.35,0.1 | smd 1.6 x 1.4: P$5 -3.15,2.55; P$6 3.25,2.55
WS2812B = smd 1.5 x 0.9: 1-VDD 2.45,-1.65; 2-DOUT 2.45,1.65; 3-GND -2.45,1.65; 4-DIN -2.45,-1.65
SOT23-3 = smd 0.8 x 0.9: 1 -0.95,-1; 2 0.95,-1; 3 0,1.1
SC70-6 = smd 0.3 x 0.66: 1 -0.65,-0.92; 2 0,-0.92; 3 0.65,-0.92; 4 0.65,0.92; 5 0,0.92; 6 -0.65,0.92
R0402 = smd 0.7 x 0.9: 1 -0.65,0; 2 0.65,0
R0805 = smd 1.3 x 1.5: 1 -0.95,0; 2 0.95,0
SWITCH-SPST-SMD-A = smd 0.7 x 1.5: 1 -2.25,-1.75; 2 -0.75,-1.75; 3 2.25,-1.75 | smd 1 x 0.6: GND1 -3.65,1; GND3 3.65,1 | smd 1 x 0.8: GND2 -3.65,-1.1; GND4 3.65,-1.1 | hole 0.9: -1.5,0; 1.5,0
PAD-JUMPER-3-2OF3_NC_BY_TRACE_YES_SILK_FULL_BOX = smd 0.635 x 1.27: 1 -0.813,0; 2 0,0; 3 0.813,0
SOT23-5 = smd 0.55 x 1.2: 1 -0.95,-1.3; 2 0,-1.3; 3 0.95,-1.3; 4 0.95,1.3; 5 -0.95,1.3
SSOP20_L = smd 0.381 x 1.143: 1 -2.857,-2.68; 2 -2.223,-2.68; 3 -1.587,-2.68; 4 -0.953,-2.68; 5 -0.318,-2.68; 6 0.318,-2.68; 7 0.953,-2.68; 8 1.587,-2.68; 9 2.223,-2.68; 10 2.857,-2.68; 11 2.857,2.68; 12 2.223,2.68; 13 1.587,2.68; 14 0.953,2.68; 15 0.318,2.68; 16 -0.318,2.68; 17 -0.953,2.68; 18 -1.587,2.68; 19 -2.223,2.68; 20 -2.857,2.68
SOIC-8 = smd 0.61 x 1.702: 1 -1.905,-3.251; 2 -0.635,-3.251; 3 0.635,-3.251; 4 1.905,-3.251; 5 1.905,3.251; 6 0.635,3.251; 7 -0.635,3.251; 8 -1.905,3.251
QFN48-0.4MM = smd 0.8 x 0.23: 1 -2.95,2.2; 2 -2.95,1.8; 3 -2.95,1.4; 4 -2.95,1; 5 -2.95,0.6; 6 -2.95,0.2; 7 -2.95,-0.2; 8 -2.95,-0.6; 9 -2.95,-1; 10 -2.95,-1.4; 11 -2.95,-1.8; 12 -2.95,-2.2; 25 2.95,-2.2; 26 2.95,-1.8; 27 2.95,-1.4; 28 2.95,-1; 29 2.95,-0.6; 30 2.95,-0.2; 31 2.95,0.2; 32 2.95,0.6; 33 2.95,1; 34 2.95,1.4; 35 2.95,1.8; 36 2.95,2.2 | smd 0.23 x 0.8: 13 -2.2,-2.95; 14 -1.8,-2.95; 15 -1.4,-2.95; 16 -1,-2.95; 17 -0.6,-2.95; 18 -0.2,-2.95; 19 0.2,-2.95; 20 0.6,-2.95; 21 1,-2.95; 22 1.4,-2.95; 23 1.8,-2.95; 24 2.2,-2.95; 37 2.2,2.95; 38 1.8,2.95; 39 1.4,2.95; 40 1,2.95; 41 0.6,2.95; 42 0.2,2.95; 43 -0.2,2.95; 44 -0.6,2.95; 45 -1,2.95; 46 -1.4,2.95; 47 -1.8,2.95; 48 -2.2,2.95 | smd 4.3 x 4.3: EP 0,0
EVQQ2 = smd 3.2 x 1: P$1 -3.4,2; P$2 3.4,2; P$3 -3.4,-2; P$4 3.4,-2
CAP_PAD = smd 6.5 x 6.5: P$1 0,0
CRYSTAL-SMD-3.2X2.5 = smd 1.2 x 1.1: 1 -1.175,-0.875; 2 1.175,-0.875; 3 1.175,0.875; 4 -1.175,0.875
CRYSTAL-SMD-3.2X1.5MM = smd 1 x 1.8: P$1 -1.25,0; P$2 1.25,0

### Placement (x,y rotation side)
AD  57.15,2.54 0 top
C1  32.9,43.9 270 top
C2  8.78,35.18 90 top
C3  9.44,17.65 270 top
C4  54.2,43.8 270 top
C5  43.9,43.7 270 top
C6  9.53,32.44 270 top
C12  15.66,35.54 0 top
C13  15.82,37.05 0 top
C14  12.51,38.24 180 top
C15  7.41,38.87 90 top
C16  56.48,10.83 270 top
C17  6.83,20.93 0 top
C18  6.33,26.21 180 top
C19  18.05,12.86 270 top
C20  20.51,13.64 270 top
C21  4.79,18.49 270 top
C22  21.78,35.56 0 top
C23  12.84,12.77 270 top
C28  14.32,10.23 0 top
C36  10.71,17.65 270 top
C37  16.12,16.75 270 top
C38  17.39,16.75 270 top
C39  21.07,16.22 0 top
C40  23.34,29.35 0 top
C41  21.73,25.04 0 top
C42  21.3,18.39 180 top
C43  21.4,23.67 180 top
C44  6.06,18.49 90 top
CHG1  47.67,12.68 90 top
D1  24.83,34.49 270 top
D3  7.29,35.36 90 top
D4  24.36,44.92 180 top
D5  21.83,44.92 180 top
D9  2.38,24.5 90 top
E2  14.57,7.69 180 top
ICSP  64.9,27.94 270 top
IOH  30.23,50.8 180 top
IOL  54.61,50.8 180 top
JP6  64.98,17.65 270 top
JP7  1.86,42.03 270 top
L3  13.68,15.31 0 top
LED1  37.36,43.12 180 top
LED2  48.7,43.1 180 top
LED3  58.8,43.1 180 top
LOGO2  53.97,21.54 0 bottom
POWER  36.83,2.54 0 top
Q3  54.95,14.94 270 top
Q5  25.73,22.68 0 top
R1  42.1,43.8 270 top
R3  23.76,47.06 0 top
R4  26.41,32.06 270 top
R7  7.73,42.75 0 top
R8  7.73,41.58 0 top
R12  18.48,36.75 90 top
R13  15.72,46.77 0 top
R16  21.16,47.03 0 top
R18  49.68,12.03 90 top
R19  49.48,9.43 0 top
R20  9.26,38.95 270 top
R21  18.68,17.23 270 top
R22  7.33,18.49 270 top
R29  23.59,22.5 90 top
R30  27.96,22.66 270 top
R32  2.14,22.38 180 top
R33  6.71,16.27 0 top
S1  1.72,30.64 90 top
SJ1  24.04,31.71 90 top
U1  6.76,31.96 270 top
U4  15.46,42.43 180 top
U5  52.78,10.43 90 top
U6  17.35,32 270 top
U10  13.68,24.2 90 top
U$1  KALAM32-DEV  [KALAM32-DEV]  29.5,19.4 0 top
U$2  PROTY_LOGO_WITH_TEXT  [PROTY_WITH_TEXT]  1.04,1.19 0 top
U$5  36.76,20.25 0 bottom
U$8  34.8,15.1 0 top
U$9  25.3,39.5 180 top
U$10  36.1,29 0 top
U$11  54.5,29 0 top
U$12  52.4,35.7 0 bottom
U$13  25.6,0.9 0 bottom
Y2  6.53,23.47 90 top
Y3  20.5,20.93 90 top

### Tracks (layer width: path | path; a pad name or v marks a point on that pad's centre or on a via)
0  (via drill 0.3)
  Top 0.2: U10.23 17.2,26 18.9,27.7 24,27.7 v24.3,27.4 | R33.1 4.77,16.27 v4.7,16.2 | U$9.P$3 28.7,39.9 v27.4,38.6
  Top 0.254: v19.3,15.2 19.5,15.4 v26.4,15.4 | Q5.6 25.08,24.72 v24.4,25.4
  Bottom 0.2: v19.3,15.2 18.8,15.2 18.1,15.9 18.1,16.4 16.5,18 16.5,19.4 15.1,20.8 10.9,20.8
  Bottom 0.254: v4.7,16.2 4.8,16.3 8.9,16.3 9.9,17.3 9.9,19.8 10.9,20.8 | v26.4,15.4 27,16 27,25.1 26.4,25.7 24.7,25.7 v24.4,25.4 24.3,25.5 v24.3,27.4 24.3,28.4 26.9,31 26.9,38.1 v27.4,38.6
2  (via drill 0.3)
  Top 0.2: U10.22 17.4,25.6 19.1,27.3 23.2,27.3 23.8,26.7 26.5,26.7 v26.8,27
  Bottom 0.254: IOL.5 53.34,43.34 47.5,37.5 28.6,37.5 28,36.9 28,29.8 27.3,29.1 27.3,27.5 v26.8,27
3.3V  (via drill 0.3)
  Top 0.178: U10.4 12.68,18.02 13.2,17.5 | 15.72,18 C37.1
  Top 0.2: U10.1 11.48,20.58 10.71,19.81 C36.1 | U10.4 U10.3 | C41.1 20.74,25.24 20.6,25.1 | U10.46 10,22.8 9.6,22.4 9.6,21.2 v9,20.6 | C6.1 9.15,32.91 U1.5 8.06,32.04 v8.04,32.01 7.21,32.01 6.5,31.3 6.5,30.8 v4.9,29.2 | C41.1 20.88,25.98 v21.1,26.2 | 13.2,17.5 13.4,17.3 15.82,17.3 C37.1 | U10.43 8.9,24 v8.6,23.7 | U10.37 10.73,27.57 10.1,28.2 9.4,28.2 v8.5,29.1 | 20.85,24.9 C41.1 | U10.19 17.8,24.4 18.8,25.4 20.52,25.4 C41.1
  Top 0.254: C37.1 C38.1 17.19,18.01 18.68,16.52 R21.2 20.07,16.38 C39.1 20.22,16.82 20.5,17.1 v24.6,17.1 26.9,17.1 29.3,14.7 29.3,12.6 30.4,11.5 30.4,2.62 POWER.2 | C36.1 C3.1 9.1,18.5 8.4,17.8 v8.4,17.7 8.4,17.12 R33.2 | 24.5,40.2 24.5,42.5 25.3,43.3 25.3,44.6 25.6,44.9 32.75,44.9 C1.1 | 24.5,40.2 24.5,35.04 D1.A 23.95,32.61 SJ1.3 24.23,32.53 v25.1,33.4 | C6.1 11.49,33.19 12.8,34.5 18.3,34.5 19.4,35.6 19.4,39.5 20.1,40.2 24.5,40.2 | LED3.1-VDD 59.55,44.75 v59.6,44.8
  Top 0.406: LED3.1-VDD 54.3,44.75 C4.1 53.25,45.6 44.1,45.6 | LED2.1-VDD 44.1,44.75 | 44.1,44.75 C5.1 | C1.1 32.92,44.77 LED1.1-VDD 35.73,45.6 44.1,45.6 | 44.1,44.75 44.1,45.6
  Bottom 0.2: v8.04,32.01 8.23,31.81 8.23,29.36 v8.5,29.1
  Bottom 0.254: v8.4,17.7 8.4,19.9 v9,20.6 9,23.3 v8.6,23.7 6.8,23.7 5.1,25.4 5.1,29 v4.9,29.2 | v24.6,17.1 24.3,17.1 24.3,17.2 21.9,19.6 21.9,25.4 v21.1,26.2 22,27.1 22,28.4 25.1,31.5 v25.1,33.4 | ICSP.2 66.17,31.73 63.5,34.4 63.5,42.8 61.5,44.8 v59.6,44.8
  Bottom 0.406: POWER.2 30.48,4.28 31.4,5.2 34.8,5.2 35.56,4.44 POWER.4
3.3V_F
  Top 0.254: U4.3 17.04,44.14 14.5,41.6 U4.14 U4.13 13.87,38.94 C14.1
5
  Top 0.2: U10.34 12.28,28.22 12,28.5 11.8,28.5 11,29.3 11,29.9 10.2,30.7 9.1,30.7 8.1,29.7 6.7,29.7 4.7,27.7 4,27.7 3.6,27.3 3.6,26.2 3.26,25.86 D9.A
16  (via drill 0.3)
  Top 0.2: U10.25 15.95,27.15 17.3,28.5 25.5,28.5 v26.7,29.7
  Bottom 0.2: v26.7,29.7 27.5,30.5 27.5,37.2 28.3,38 46.3,38 50.8,42.5 IOL.6
17  (via drill 0.3)
  Top 0.2: U10.27 15.08,28.18 15.2,28.3 15.9,28.3 17.6,30 17.6,31.3 18.3,32 v22,32 | v40.3,48 42.92,48 IOL.8
  Bottom 0.2: v22,32 22.4,32 23.5,33.1 23.5,37.5 26.1,40.1 28.9,40.1 29.8,39.2 39.4,39.2 40.5,40.3 40.5,47.8 v40.3,48
32K_XN
  Top 0.2: U10.13 16.63,21.67 17.4,20.9 19.22,20.9 Y3.P$2
  Top 0.254: C43.2 20.55,22.53 Y3.P$2
32K_XP
  Top 0.2: Y3.P$1 19.78,20.5 17.1,20.5 16.35,21.25 U10.12
  Top 0.254: C42.2 20.45,19.62 Y3.P$1
37  (via drill 0.3)
  Top 0.2: U10.6 13.48,19.59 v13.78,19.29
  Top 0.254: C19.1 17.89,13.71 v17,14.6
  Bottom 0.178: 16.7,15.6 16.7,14.9 v17,14.6
  Bottom 0.2: 16.7,15.6 16.7,15.8 15,17.5 14.3,17.5 14.1,17.7 14.1,18.97 v13.78,19.29
38  (via drill 0.3)
  Top 0.2: U10.7 13.88,20.22 14.84,19.26 v14.84,18.27 | C20.1 20.2,14.49 v19.4,13.7
  Bottom 0.2: 15.01,18.1 v14.84,18.27 17.1,16.01 17.1,15.5 18.9,13.7 v19.4,13.7
ADC1:0/GPI36  (via drill 0.3)
  Top 0.2: U10.5 13.08,18.72 v13.4,18.3
  Top 0.254: C19.2 17.99,12.01 v16.9,13.1
  Bottom 0.178: 16.3,15.4 16.3,13.7 v16.9,13.1
  Bottom 0.2: 16.3,15.4 16.3,15.5 14.7,17.1 13.7,17.1 13.4,17.4 v13.4,18.3 | AD.3 55.86,2.54 53,5.4 49.3,5.4 47.3,7.4 47.3,9.5 45.7,11.1 18.9,11.1 v16.9,13.1
ADC1:3/GPI39  (via drill 0.3)
  Top 0.178: C20.2 21.39,12.79 v21.8,12.8 | U10.8 14.28,20.32 15.65,18.95
  Top 0.2: v15.8,18.85 15.75,18.85 15.65,18.95
  Bottom 0.178: 19.2,14.4 19.8,14.4
  Bottom 0.2: 19.2,14.4 19,14.4 17.7,15.7 17.7,16.1 15.8,18 v15.8,18.85 | 19.8,14.4 20.2,14.4 v21.8,12.8 23,11.6 46.2,11.6 48,9.8 48,7.5 49.6,5.9 55.06,5.9 AD.4
ADC1:6/GPI34  (via drill 0.3)
  Top 0.2: U10.10 15.08,20.62 15.7,20 16.4,20 16.9,19.5 17.8,19.5 v18.1,19.2 | AD.2 53.34,8.26 v53.3,8.3
  Bottom 0.2: v18.1,19.2 18.1,18.7 23.9,12.9 47,12.9 49.5,10.4 49.5,8.2 50.3,7.4 52.4,7.4 v53.3,8.3
ADC1:7/GPI35  (via drill 0.3)
  Top 0.2: U10.11 15.48,20.72 15.8,20.4 16.6,20.4 16.9,20.1 18.7,20.1 v19,19.8 | AD.1 50.8,8.2 v50.7,8.3
  Bottom 0.2: v19,19.8 19,18.5 24.2,13.3 47.7,13.3 50.7,10.3 v50.7,8.3
CAP_10N
  Top 0.178: C21.2 C44.1 R22.2 8.12,18.42 8.12,18.99 8.63,19.5 9.64,19.5 10.73,20.59 U10.48
CHIP_PU
  Top 0.178: R21.1 18.68,18.12 | U10.9 14.68,20.42 15.5,19.6
  Top 0.2: 18.68,18.32 R21.1 18.26,18.5 17.3,18.5 16.2,19.6 15.5,19.6 | 18.82,18.08 18.82,17.98 18.92,17.98 19.3,17.6 23.1,17.6 26.25,20.75
  Top 0.254: Q5.3 26.38,20.88 26.25,20.75 29.3,17.7 29.3,15.9 31.4,13.8 U$8.P$3 | R21.1 18.82,18.08
  Top 0.406: POWER.3 33.02,11.48 U$8.P$3
CS/GPIO12  (via drill 0.3)
  Top 0.2: v19.1,24.7 18.7,24.7 18,24 U10.18
  Bottom 0.254: IOH.3 39.3,48.08 39.3,40.7 38.3,39.7 29.9,39.7 29.1,40.5 25.9,40.5 23,37.6 23,34 21.1,32.1 21.1,29.2 18.6,26.7 18.6,25.2 v19.1,24.7
D+
  Top 0.254: JP7.3 6.67,41.98 R8.1
D-
  Top 0.254: JP7.2 6.97,42.63 R7.1
DAC1/GPIO25  (via drill 0.3)
  Top 0.2: U10.14 17.2,22.4 17.7,21.9 v17.7,21.6 | IOH.1 41.66,50.46 39.1,47.9 v38.3,47.9
  Bottom 0.2: v38.3,47.9 38.3,40.8 37.8,40.3 30.2,40.3 29.5,41 25.8,41 22.5,37.7 22.5,34.3 20.7,32.5 20.7,29.5 17.4,26.2 17.4,21.9 v17.7,21.6
DAC2/GPIO26  (via drill 0.3)
  Top 0.2: U10.15 17.9,22.8 v18.2,22.5
  Bottom 0.2: IOL.7 48.26,41.56 45.1,38.4 29.4,38.4 28.5,39.3 26.6,39.3 24.4,37.1 24.4,31.4 21.6,28.6 21.6,28 20.4,26.8 20.4,24.7 19.7,24 18.9,24 18.2,23.3 v18.2,22.5
DTR  (via drill 0.3)
  Top 0.254: Q5.1 23.3,21.76 | 23.3,21.76 R29.1 | 23.3,21.76 23.3,20.7 v23.4,20.4 | v25.4,36.3 25.4,42.5 26.3,43.4 v26.3,44.1 | U4.1 18.31,43.11 v18.1,42.9
  Bottom 0.254: v23.4,20.4 23.4,24.3 22.5,25.2 22.5,28.1 25.9,31.5 25.9,35.8 v25.4,36.3 | v18.1,42.9 20.6,42.9 21.9,44.2 26.2,44.2 v26.3,44.1
FLASH_SCK  (via drill 0.3)
  Top 0.2: U10.31 13.48,28.72 12.5,29.7 v12.5,30 | U6.6 19.16,31.36 v18.3,30.6
  Bottom 0.2: v12.5,30 12.8,29.7 17,29.7 17.9,30.6 v18.3,30.6
FLASH_SCS
  Top 0.2: U10.30 13.88,28.88 14.5,29.5 15.2,29.5 15.6,29.9 15.6,31 16.2,31.6 16.2,33.1 15.39,33.91 U6.1
FLASH_SDI  (via drill 0.3)
  Top 0.2: U10.33 12.68,28.42 12.2,28.9 12,28.9 11.4,29.5 11.4,30.5 v11.1,30.8 | U6.5 18.89,30.09 v18.4,29.6
  Bottom 0.2: v11.1,30.8 11.3,30.6 11.3,30 12.1,29.2 17.3,29.2 17.7,29.6 v18.4,29.6
FLASH_SDO
  Top 0.2: U10.32 13.08,28.62 12.4,29.3 12.2,29.3 11.8,29.7 11.8,31.9 12.54,32.63 U6.2
FLASH_SHD
  Top 0.2: U10.28 14.68,28.48 14.9,28.7 15.7,28.7 17.1,30.1 17.1,31.5 18.4,32.8 20.43,32.8 U6.7
FLASH_SWP  (via drill 0.3)
  Top 0.2: U10.29 14.28,28.68 14.7,29.1 15.4,29.1 16.3,30 v16.3,30.6 | U6.3 14.87,31.36 v15.5,32
  Bottom 0.2: v16.3,30.6 16.3,31.2 v15.5,32
FLASH_VDD
  Top 0.2: SJ1.1 24.04,30.69 C40.1 22.24,28.9 17.1,28.9 16.1,27.9 15.6,27.9 15.48,27.78 U10.26
GND  (via drill 0.25, 0.3)
  Top 0.178: 15.75,8.4 17.95,8.4
  Top 0.254: C12.2 16.31,36.59 C13.2 | 22.68,24.9 C41.2 22.25,24.71 C43.1 | Y2.2 7.41,25.98 C18.1 | C15.2 9.05,39.81 R20.1 | U6.4 13.61,30.09 13,30.7
  Top 0.61: POWER.7 43.18,6.38 46.23,9.43 R19.1
  Top 0.762: E2.GND 15.75,8.4 | 17.95,8.4 E2.GND2
  Bottom 0.406: POWER.7 POWER.6
  other vias: 58.2,9.74 14.95,24.2 14.95,22.93 13.68,22.93 12.41,22.93 12.41,24.2 12.41,25.47 13.68,25.47 14.95,25.47 52.83,12.85 18.13,8.2 19.4,8.2 20.67,8.2 21.94,8.2 23.21,8.2 24.48,8.2 16.86,8.2 15.59,8.2 13.55,8.2 12.29,8.2 11.02,8.2 9.74,8.2 8.47,8.2 7.21,8.2 5.93,8.2 4.67,8.2 2.12,8.2 0.85,8.2 15.21,9.12 12.79,9.12 14.19,11.35 11.65,11.25 12.29,10.36 13.94,12.52 11.78,12.52 13.94,13.79 11.78,13.79 11.68,15.06 11.78,16.33 14,16.4 15.21,12.52 15.31,13.49 15.21,11.35 16.86,9.47 18.13,9.47 19.4,9.47 11.52,9.21 11.02,10.36 10.38,11.25 10.51,12.52 10.51,13.79 10.51,15.06 9.74,9.47 8.47,9.47 7.21,9.47 5.93,9.47 4.67,9.47 4.4,21.33 3.47,17.18 4.49,23.69 13.68,24.2 21.5,11.8 15.59,14.42 4.44,22.54 7.3,27.6 4.3,25.5 23.4,19.4 27.5,15.3 4.4,36.5 17.5,33.1 12.6,31.2 24.8,20.5 16.7,38.4 3.4,31.4 4.3,35 10.4,43.7 9.6,49.6 12,49.5 11.3,32.4 25.9,18.5 20.5,39.1 30.3,43.6 36.9,43.7 43,41.5 47.3,43.6 53.1,41.2 55.8,43 59.8,40.2 44,17.7 50.3,17.6 58,17.9 65.6,18.4 64.1,22.7 54.2,37.6 25.6,16.3 26.5,28.5 1.3,19.4 43.4,9.2
  pour Bottom: 0.1,53.4 68.5,53.4 68.5,7.8 0.1,7.8
  pour Top: 0.1,53.3 68.5,53.3 68.5,7.8 0.1,7.8
GP14  (via drill 0.3)
  Top 0.2: U10.17 19.2,23.6 v19.4,23.3
  Bottom 0.2: v19.4,23.3 20.5,22.3 20.5,18.4 24.7,14.2 45.7,14.2 47.4,15.9 59.4,15.9 61.2,17.7 61.2,40.5 58.1,43.6 58.1,47.94 IOL.2
GP27  (via drill 0.3)
  Top 0.2: U10.16 18.5,23.2 18.9,22.8 18.9,21.8 v18.7,21.6
  Bottom 0.2: v18.7,21.6 20.1,20.2 20.1,18.2 24.5,13.8 46,13.8 47.6,15.4 59.7,15.4 61.8,17.5 61.8,40.8 58.7,43.9 58.7,46 IOL.1
LNA_IN
  Top 0.178: L3.1 12.84,15.3 | U10.2 11.88,19.92
  Top 0.762: L3.1 12.83,16.75 11.88,17.7 11.88,19.92 | 12.84,15.3 C23.1
MISO/GPIO19  (via drill 0.3)
  Top 0.178: 10,26.5 10,27
  Top 0.2: U10.38 10.1,26 10,26.1 10,26.5 | v7.5,28.7 7.8,28.4 8.6,28.4 9.2,27.8 9.6,27.8 10,27.4 10,27
  Top 0.254: IOH.5 31.5,50.4 35.2,46.7 62,46.7 63.4,45.3 63.4,30.71 ICSP.1
  Bottom 0.2: IOH.5 27.8,47.1 25.5,47.1 25.1,46.7 9.9,46.7 8.2,45 8.2,33.6 7.3,32.7 7.3,28.9 v7.5,28.7
MOSI/GPIO23  (via drill 0.3)
  Top 0.2: U10.36 11.48,27.42 10,28.9 v9.7,28.9
  Top 0.254: IOH.4 34.04,50.26 37.1,47.2 62.7,47.2 63.9,46 63.9,34 65.3,32.6 67,32.6 67.9,31.7 67.9,29.67 ICSP.4
  Bottom 0.2: v9.7,28.9 8.7,29.9 8.7,44.8 10.2,46.3 25.5,46.3 25.8,46.6 29.84,46.6 IOH.4
N$1  (via drill 0.3)
  other vias: 65.5,38.6
N$2  (via drill 0.3)
  other vias: 29.8,19.2
N$3
  Top 0.406: LED2.4-DIN 50.75,44.75 48.5,42.5 45.5,42.5 43,40 36.38,40 LED1.2-DOUT
N$4
  Top 0.406: LED2.2-DOUT 46.55,41.45 47.8,40.2 57.9,40.2 61.2,43.5 61.2,44.7 LED3.4-DIN
N$5
  Top 0.406: LED1.4-DIN 41.98,44.77 R1.1
N$8
  Top 0.254: D5.A 21.83,47.01 R16.2
N$9
  Top 0.254: R7.2 11.75,42.75 13.23,41.27 U4.12
N$10
  Top 0.254: D4.A 24.36,47.02 R3.2
N$11
  Top 0.254: R8.2 11.72,41.58 12.6,40.7 U4.11
N$12
  Top 0.254: R4.1 26.41,33.8 D1.C
N$13  (via drill 0.3)
  Top 0.254: U5.1 52.98,9.48 v52.9,9.4
  Top 0.406: CHG1.C 46.92,13.02 v48.2,14.3
  Bottom 0.406: v52.9,9.4 52.9,9.6 v48.2,14.3
N$14
  Top 0.61: U1.3 4.58,31.01 S1.2
N$16
  Top 0.406: R18.2 CHG1.A
N$17
  Top 0.254: SJ1.2 24.02,31.7 23.2,31.7 22.7,32.2 22.7,32.9 21.7,33.9 21.1,33.9 U6.8
  Top 0.406: C22.1 20.93,34.07 21.1,33.9
N$19
  Top 0.61: U5.5 50.18,9.48 R19.2
N$23
  Top 0.254: Q5.5 25.73,23.23 25.4,22.9 23.84,22.9 R29.2
N$24
  Top 0.254: Q5.2 25.73,22.33 26,22.6 27.17,22.6 R30.2
N$25
  Top 0.2: U10.45 9.8,23.2 9,22.4 7.72,22.4 Y2.1
  Top 0.254: C17.2 7.68,22.02 Y2.1
N$26
  Top 0.2: U10.44 9.7,23.6 9.1,23 8.3,23 7.7,23.6 6.5,23.6 5.66,24.44 Y2.3
  Top 0.406: Y2.3 5.66,26.03 C18.2
N$29
  Top 0.254: D9.C 1.5,22.7 R32.2
N$30
  Top 0.178: C44.2 R22.1 7.95,19.34 8.47,19.86 9.45,19.86 10.05,20.45 10.05,22.24 10.21,22.4 U10.47
RTS  (via drill 0.3)
  Top 0.254: R30.1 27.87,23.6 Q5.4 26.38,24.12 v25.9,24.6 | U4.2 17.68,43.68 v16.9,42.9 | v26.2,37.3 26.3,37.4 26.3,42.7 v27.3,43.7
  Bottom 0.254: v25.9,24.6 23.9,24.6 23,25.5 23,27.9 26.4,31.3 26.4,37.1 v26.2,37.3 | v16.9,42.9 17.6,42.2 20.7,42.2 22.2,43.7 25.5,43.7 25.9,43.3 26.9,43.3 v27.3,43.7
RXD
  Top 0.254: U4.4 16.41,46.66 R13.2
RXLED
  Top 0.254: U4.17 16.41,40.81 16.7,41.1 18.7,41.1 20.2,42.6 22.92,42.6 D4.C
SCK/GPIO18  (via drill 0.3)
  Top 0.2: v9.6,30 10.1,30 10.5,29.6 10.5,29.2 11.88,27.82 U10.35
  Top 0.254: ICSP.3 63.46,27.94 62.5,28.9 62.5,45.2 61.5,46.2 31.6,46.2 30.5,47.3 | 30.5,47.3 v29.1,45.9 | IOH.6 28.96,48.84 30.5,47.3
  Bottom 0.2: v29.1,45.9 10.4,45.9 9.1,44.6 9.1,30.5 v9.6,30
SCL/GPIO22  (via drill 0.3)
  Top 0.2: U10.39 9.9,25.6 9.6,25.9 9.6,26.5 v9.2,26.9
  Bottom 0.2: IOH.10 18.8,47.8 18.1,47.1 9.7,47.1 7.8,45.2 7.8,33.8 6.9,32.9 6.9,29.6 6.6,29.3 6.6,27.2 6.9,26.9 v9.2,26.9 11.1,25 11.1,22.3 11.8,21.6 15.5,21.6 17.3,19.8 17.3,18.9 23.7,12.5 46.7,12.5 49,10.2 49,7.9 50,6.9 59.14,6.9 AD.6
SDA/GPIO21  (via drill 0.3)
  Top 0.2: v17,48.5 19.3,48.5 21.34,50.54 IOH.9 | U10.42 8.9,24.4 v8.6,24.7
  Bottom 0.2: v17,48.5 8.1,48.5 5.8,46.2 5.8,26.1 7.2,24.7 v8.6,24.7 9.6,24.7 10.6,23.7 10.6,22.2 11.6,21.2 15.3,21.2 16.9,19.6 16.9,18.7 23.5,12.1 46.4,12.1 48.5,10 48.5,7.7 49.8,6.4 57.1,6.4 AD.5
TOUCH/4  (via drill 0.3)
  Top 0.178: 16.63,26.93 17.8,28.1 24.7,28.1 25.1,27.7 27.3,27.7 v28.2,28.6 | U$11.P$1 54.5,34 v53.4,35.1
  Top 0.2: 16.63,26.93 U10.24
  Bottom 0.178: v28.2,28.6 29,29.4 29,33.3 30.8,35.1 v53.4,35.1
TOUCH/15
  Top 0.178: U$10.P$1 30.5,29 27.8,26.3 23.4,26.3 22.8,26.9 19.2,26.9 17.5,25.2
  Top 0.2: 17.5,25.2 U10.21
TRACE_ANT1
  Top 0.178: E2.ANT 14.57,8.02
  Top 0.762: 14.57,8.02 arc46 14.04,9.19 arc-35 C28.1 arc33 13,11.25 arc-37 12.87,11.55 12.87,11.9 C23.2
TXD
  Top 0.254: U4.20 18.31,37.56 R12.2
TXLED  (via drill 0.3)
  Top 0.254: D5.C 20.34,44.04 v19.9,43.6 | U4.10 12.6,44 v12.9,43.7
  Bottom 0.254: v19.9,43.6 13,43.6 v12.9,43.7
U0RXI  (via drill 0.3)
  Top 0.2: R12.1 18.2,36.1 v17.5,35.4 | U10.40 9.8,25.2 9.1,25.9 9.1,26 8.3,26.8 v8.3,27.7
  Bottom 0.2: v17.5,35.4 17.1,35 12.2,35 10.4,33.2 10.4,28.1 10,27.7 v8.3,27.7
U0TXO  (via drill 0.3)
  Top 0.2: U10.41 9.6,24.8 8.7,25.7 v8.4,25.7 | R13.1 15.07,46.83 v14.1,47.8
  Bottom 0.2: v8.4,25.7 8.3,25.9 6.7,25.9 6.2,26.4 6.2,45.6 8.4,47.8 v14.1,47.8
VBAT
  Top 0.305: U5.3 56.08,11.38 C16.1
  Top 0.406: U5.3 53.08,11.38 52.2,10.5 42.5,10.5 38.1,6.1 POWER.5
  Top 0.813: C16.1 56.05,12.22 Q3.3 56.05,15.85 56.85,16.65 JP6.2
VIN  (via drill 0.3)
  Top 0.406: C2.1 11.63,34.53 v12.9,35.8 | Q3.2 54.09,13.99 55,14.9 55,16.3 58.4,19.7 61.5,19.7 61.9,20.1 61.9,37.9 60.6,39.2 35.2,39.2 33.6,40.8 33.6,41.5 33.1,42 31.5,42 v31,41.5
  Top 0.61: S1.3 3.48,32.91 U1.1 6.76,34.21 D3.C 8.46,34.21 C2.1
  Bottom 0.406: v12.9,35.8 13.4,36.3 20.3,36.3 25.8,41.8 30.7,41.8 v31,41.5
VUSB  (via drill 0.3)
  Top 0.254: C12.1 14.87,35.67 C13.1 15.14,37.32 U4.15 15.14,40.94 15.9,41.7 18.6,41.7 19,42.1 19,44.2 v19.6,44.8 20.51,45.71 R16.1 20.6,47.13 20.6,47.6 21,48 22.4,48 23.11,47.29 R3.1
  Top 0.3: JP7.1 5.68,43.28 7.3,44.9 v10.8,44.9
  Top 0.406: U5.4 51.6,11.5 51.6,14.9 52.59,15.89 Q3.1 53.95,16.45 57.9,20.4 60.8,20.4 61.2,20.8 61.2,37.4 60.2,38.4 34.1,38.4 32.8,39.7 32.8,41 v32.6,41.2 | C15.1 7.79,38.3 R20.2 9.4,38.3 10.6,37.1 v12.9,37.1 12.95,37.05 C13.1
  Top 0.61: D3.A 7.29,37.8 C15.1 | U5.4 R18.1
  Bottom 0.3: v10.8,44.9 19.5,44.9 v19.6,44.8
  Bottom 0.406: v12.9,37.1 20.1,37.1 25.4,42.4 31.4,42.4 v32.6,41.2
WS2812/GPIO13  (via drill 0.3)
  Top 0.2: R1.2 42.1,41 v41.9,40.8 | U10.20 17.6,24.8 18.9,26.1 v19.4,26.1
  Top 0.254: IOL.3 58.42,49.82 56.6,48 v44.3,48
  Bottom 0.2: v41.9,40.8 39.9,38.8 29.6,38.8 28.7,39.7 26.4,39.7 24,37.3 24,31.5 21.2,28.7 21.2,28.5 19.4,26.7 v19.4,26.1
  Bottom 0.254: v44.3,48 43.1,48 42.1,47 42.1,41 v41.9,40.8

### Text on the board
tPlace: v1.1 | SDA | NC | GND | 13 | 12 | 11 | 10 | NC | 8 | 7 | 6 | 5 | 4 | NC | 2 | 1 | 0 | SCL | LED_TX | LED_RX | ON | SW1/ / GPIO0 | L1 | L2 | L3 | ON | PWR | T1 | T2 | + | GPIO5 | SPI ONLY | + | CHG | VBAT / Li-Ion/3.7V | RESET | IOREF | RESET | +3V3 | VBAT | GND | GND | SDA | SCL | NC | NC | A0 | A1 | A2 | A3
bPlace: v1.1 | SCL/GPIO22 | SDA/GPIO21 | SCK/GPIO18 | MISO/GPIO19 | MOSI/GPIO23 | CS/GPIO12 | DAC1/GPIO25 | GPIO17 | DAC2/GPIO26 | GPIO16 | GPIO2 | WS2812/GPIO13 | GPIO14 | GPIO27 | Get Started: http://protocentral.com/kalam32 | pc_kalam32_dev | All Analog and Digital I/Os 3.3v ONLY | SDA/GPIO21 | SCL/GPIO22 | MADE IN INDIA | ADC1:3/GPI39 | ADC1:7/GPI35 | ADC1:6/GPI34 | ADC1:0/GPI36
tNames: SCL | SDA | AREF | GND | # | # | # | # | # | # | DIGITAL | [#=PWM] | TX | RX | 1 | ANALOG IN | IOREF | RESET | 3V3 | 5V | GND | VIN | A0 | A1 | A2 | A3 | A4 | A5
bNames: designed by | MADE IN | tinker it | ITALY
214bmp: D:/SmartProjects/Snc/a4_bn_logo2.bmp